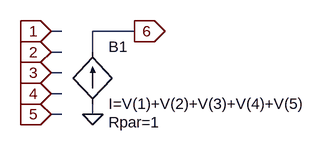
[diagram p0: schematic Summer+5.asc]
Summer+5.asc, the LTspice schematic file:
Version 4
SHEET 1 880 680
WIRE 96 288 96 272
WIRE 96 192 96 160
WIRE 96 160 160 160
WIRE 32 160 48 160
WIRE 32 192 48 192
WIRE 32 224 48 224
WIRE 32 256 48 256
WIRE 32 288 48 288
FLAG 32 160 1
IOPIN 32 160 In
FLAG 32 192 2
IOPIN 32 192 In
FLAG 160 160 6
IOPIN 160 160 Out
FLAG 96 288 0
FLAG 32 224 3
IOPIN 32 224 In
FLAG 32 256 4
IOPIN 32 256 In
FLAG 32 288 5
IOPIN 32 288 In
SYMBOL bi 96 272 M180
WINDOW 0 24 88 Left 0
WINDOW 3 24 0 Left 0
WINDOW 123 24 -28 Left 0
SYMATTR InstName B1
SYMATTR Value I=V(1)+V(2)+V(3)+V(4)+V(5)
SYMATTR Value2 Rpar=1

The netlist it stands for:
* Summer+5.asc
B1 0 6 I=V(1)+V(2)+V(3)+V(4)+V(5) Rpar=1
.backanno
.end